# Altium project lab_1_demcheva_usb_rs232.PrjPcb
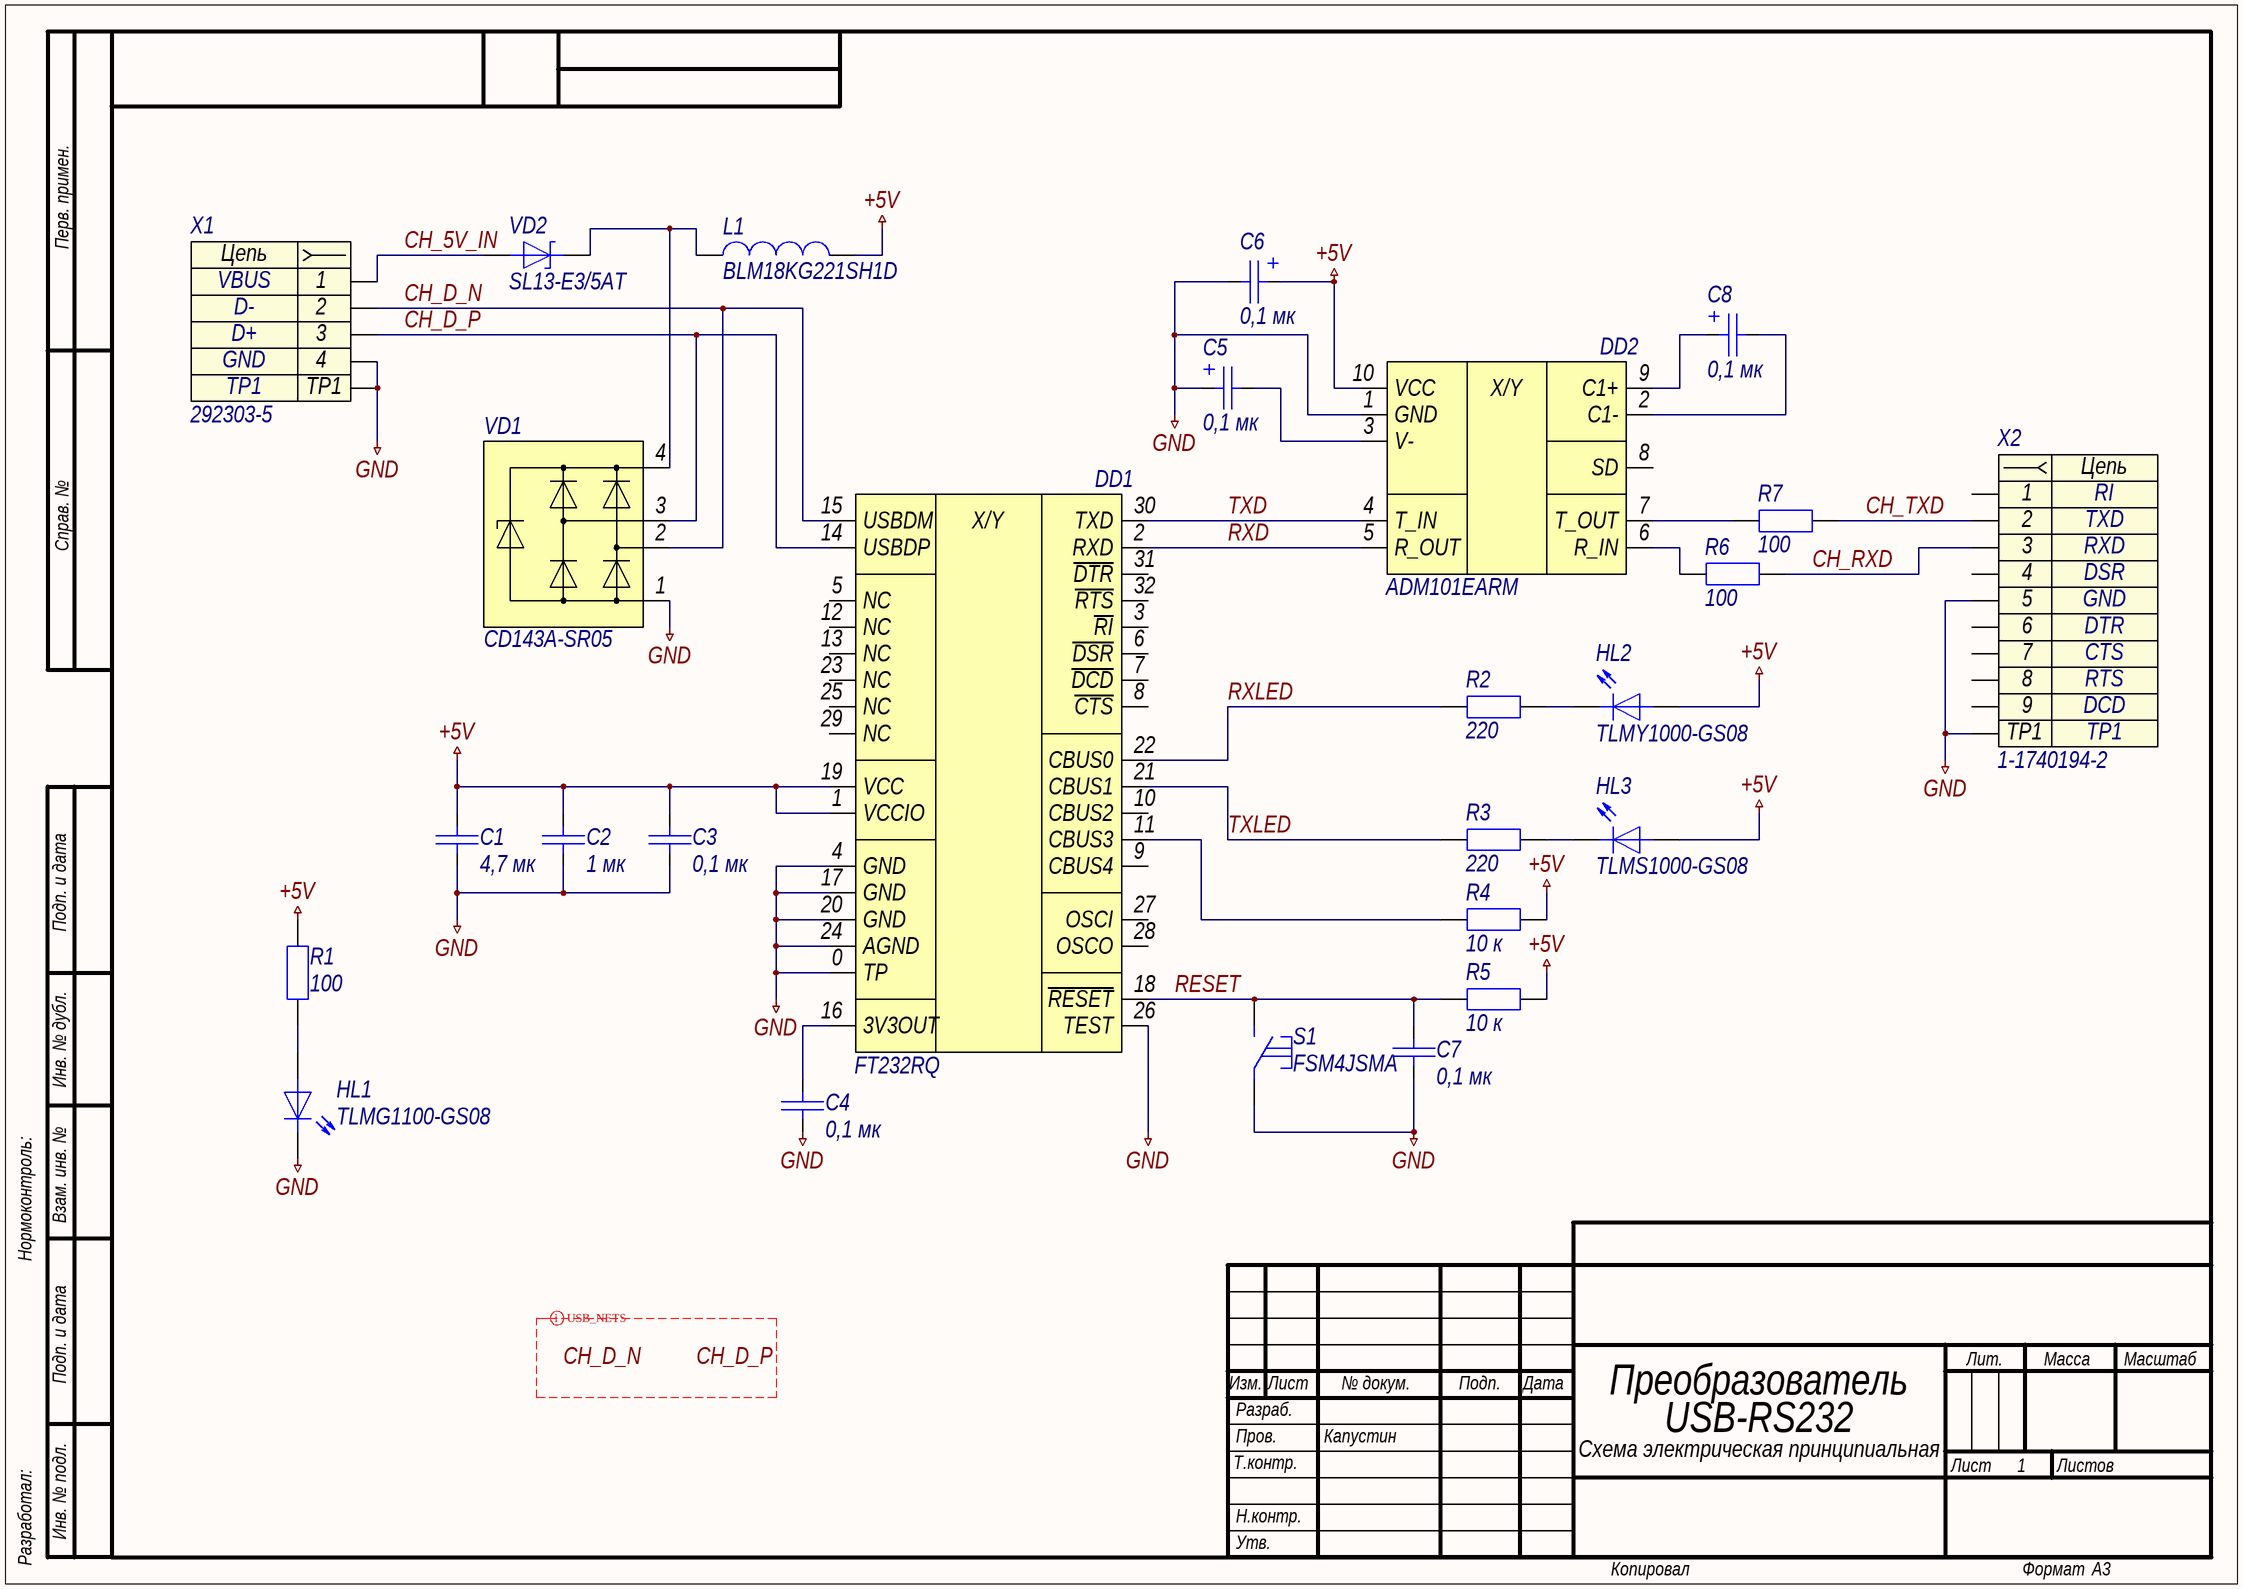
[diagram p0: lab_1_demcheva_usb_rs232.SchDoc]
approver: Капустин; check: Капустин; designation: СПБПУ.3331506.002; developer: Демчева; document_code: Ý3; document_type: Схема электрическая принципиальная; pcb_dec_number: СПБПУ.3331506.002; project: Преобразователь USB-RS232; sheets_total: 1; title: Преобразователь USB-RS232; title_line_1: Преобразователь; title_line_2: USB-RS232
1 sheet, 26 parts. Net scope: global (net labels, ports and power ports of the same name join across sheets).
Board file: lab_1_demcheva_usb_rs232.PcbDoc

## Sheet lab_1_demcheva_usb_rs232.SchDoc: Преобразователь USB-RS232
size 420 x 297 mm; ApprovedBy: Капустин; CheckedBy: Капустин; DrawnBy: Демчева; DocumentNumber: СПБПУ.3331506.002Ý3; SheetNumber: 1; SheetTotal: 1; DocumentCode: Ý3; ImagePath: СПБПУ.3331506.002

### Parts
C1  4,7 мк  [C0603]
C2  1 мк  [C0603]
C3  0,1 мк  [C0603]
C4  0,1 мк  [C0603]
C5  0,1 мк  [C1206POLAR]
C6  0,1 мк  [C1206POLAR]
C7  0,1 мк  [C0603]
C8  0,1 мк  [C1206POLAR]
DD1  FT232RQ  [QFN-32-500x500x90]
DD2  ADM101EARM  [MSOP-10]
HL1  TLMG1100-GS08  [HL0603]
HL2  TLMY1000-GS08  [HL0603]
HL3  TLMS1000-GS08  [HL0603]
L1  BLM18KG221SH1D  [BLM-2-0603]
R1  100  [R0603]
R2  220  [R0603]
R3  220  [R0603]
R4  10 к  [R0603]
R5  10 к  [R0603]
R6  100  [R0603]
R7  100  [R0603]
S1  FSM4JSMA  [FSM4JSMA]
VD1  CD143A-SR05  [SOT-143-4]
VD2  SL13-E3/5AT  [DO-214AC]
X1  292303-5  [292303-5]
X2  1-1740194-2  [1-1740194-2]

### Nets
+5V: C1.1 C2.1 C3.1 C6.1 DD1.1(VCCIO) DD1.19(VCC) DD2.10(VCC) HL2.2 HL3.2 L1.2 R1.2 R4.2 R5.2
GND: C1.2 C2.2 C3.2 C4.2 C5.1 C6.2 C7.2 DD1.0(TP) DD1.4(GND) DD1.17(GND) DD1.20(GND) DD1.24(AGND) DD1.26(TEST) DD2.1(GND) HL1.1 S1.1 VD1.1 X1.4 X1.TP1 X2.5 X2.TP1
CH_5V_IN: VD2.2 X1.1
CH_D_N: DD1.15(USBDM) VD1.2 X1.2
CH_D_P: DD1.14(USBDP) VD1.3 X1.3
CH_RXD: R6.2 X2.3
CH_TXD: R7.2 X2.2
RESET: C7.1 DD1.18(~{RESET}) R5.1 S1.2
RXD: DD1.2(RXD) DD2.5(R_OUT)
RXLED: DD1.22(CBUS0) R2.1
TXD: DD1.30(TXD) DD2.4(T_IN)
TXLED: DD1.21(CBUS1) R3.1
NetC4_1: C4.1 DD1.16(3V3OUT)
NetC5_2: C5.2 DD2.3(V-)
NetC8_1: C8.1 DD2.9(C1+)
NetC8_2: C8.2 DD2.2(C1-)
NetDD1_11: DD1.11(CBUS3) R4.1
NetDD2_6: DD2.6(R_IN) R6.1
NetDD2_7: DD2.7(T_OUT) R7.1
NetHL1_2: HL1.2 R1.1
NetHL2_1: HL2.1 R2.2
NetHL3_1: HL3.1 R3.2
NetL1_1: L1.1 VD1.4 VD2.1

Not connected (* = marked no-connect by the designer): DD1 3(~{RI}) 5(NC) 6(~{DSR}) 7(~{DCD}) 8(~{CTS}) 9(CBUS4) 10(CBUS2) 12(NC) 13(NC) 23(NC) 25(NC) 27(OSCI) 28(OSCO) 29(NC) 31(~{DTR}) 32(~{RTS}); DD2 8(SD); X2 1 4 6 7 8 9

### Layout directives
differential pair; rule Differential Pairs Routing [Pref Gap = 0.254mm    Min Gap  = 0.15mm    Max Gap  = 0.254mmPref Width = 0.381mm    Min Width  = 0.155mm    Max Width  = 0.381mm]; differential pair class USB_SIGNALS: CH_D_N, CH_D_P

### Notes on the sheet
- Labels drawn without touching a wire or pin: CH_D_N, CH_D_P
- Перв. примен.
- Справ. №
- Подп. и дата
- Инв. № дубл.
- Нормоконтроль:
- Взам. инв. №
- Изм.
- Лист
- № докум.
- Подп.
- Дата
- Лит.
- Масса
- Масштаб
- Т.контр.
- Пров.
- Разраб.
- Листов
- Разработал:
- Инв. № подл.
- Н.контр.
- Утв.
- Копировал
- Формат
- А3
- (in symbol dd0008) X/Y
- (in symbol dd0013) X/Y
- (in symbol x0002) Цепь
- (in symbol x0003) Цепь

### Library data of the parts
C1 = c0009: =Описание; ID: c0009; Фамилия: Ларионов; Описание: Конденсатор чип 0603 4,7 мкФ 25 В ±10 %; Наименование: CC0603KRX5R8BB475; Производитель: Yageo; Отклонение: ±10 %; Номинальное напряжение: 25 В; Рабочие температуры: от -55 °С до +85 °С; Корпус: 0603; Номинал: 4,7 мк; HelpURL: https://www.yageo.com/upload/media/product/productsearch/datasheet/mlcc/UPY-GPHC_X5R_4V-to-50V_26.pdf
C2 = c0007: =Описание; ID: c0007; Фамилия: Ларионов; Описание: Конденсатор чип 0603 1 мкФ 25 В ±10 %; Наименование: CC0603KRX7R8BB105; Производитель: Yageo; Отклонение: ±10 %; Номинальное напряжение: 25 В; Рабочие температуры: от -55 °С до +125 °С; Корпус: 0603; Номинал: 1 мк; HelpURL: https://www.yageo.com/upload/media/product/products/datasheet/mlcc/UPY-GPHC_X7R_6.3V-to-50V_20.pdf
C3 C4 C7 = c0005: =Описание; ID: c0005; Фамилия: Ларионов; Описание: Конденсатор чип 0603 0,1 мкФ 50 В ±5 %; Наименование: CC0603JRX7R9BB104; Производитель: Yageo; Отклонение: ±5 %; Номинальное напряжение: 50 В; Рабочие температуры: от -55 °С до +125 °С; Корпус: 0603; Номинал: 0,1 мк; HelpURL: https://www.yageo.com/upload/media/product/products/datasheet/mlcc/UPY-GPHC_X7R_6.3V-to-50V_20.pdf
C5 C6 C8 = c0011: =Описание; ID: c0011; Фамилия: Ларионов; Описание: Конденсатор чип 1206 0,1 мкФ 50 В ±10 % полярный; Наименование: 293D104X9050A2TE3; Производитель: Vishay Intertechnology, Inc.; Отклонение: ±10 %; Номинальное напряжение: 50 В; Рабочие температуры: от -55 °С до +125 °С; Корпус: 1206; Номинал: 0,1 мк; HelpURL: https://www.vishay.com/capacitors/list/product-40002/
DD1 = dd0013: =Описание; ID: dd0013; Фамилия: Демчева; Описание: Преобразователь USB-UART; Производитель: FTDI Limited; Корпус: QFN-32; Наименование: FT232RQ; HelpURL: https://www.ftdichip.com/Products/ICs/FT232R.htm
DD2 = dd0008: =Описание; ID: dd0008; Фамилия: Демчева; Описание: Приемопередатчик RS-232; Производитель: Analog Devices, Inc.; Наименование: ADM101EARM; Корпус: MSOP-10; HelpURL: https://www.analog.com/ru/products/adm101e.html#product-documentation
HL1 = hl0005: =Описание; ID: hl0005; Фамилия: Ларионов; Описание: Светодиод чип 0603 зеленый; Производитель: Vishay Intertechnology, Inc.; Цвет: Green; Номинальная сила света: 35 мкд; Номинальная длина волны: 570 нм; Номинальный прямой ток: 30 мА; Номинальное падение напряжения: 2,1 В; Рассеиваемая мощность: 90 мВт; Рабочие температуры: от -40 °С до +100 °С; Корпус: 0603; Наименование: TLMG1100-GS08; HelpURL: https://www.vishay.com/leds/list/product-83173/
HL2 = hl0003: =Описание; ID: hl0003; Фамилия: Ларионов; Описание: Светодиод чип 0603 желтый; Производитель: Vishay Intertechnology, Inc.; Цвет: Yellow; Номинальная сила света: 7,5 мкд; Номинальная длина волны: 588 нм; Номинальный прямой ток: 15 мА; Номинальное падение напряжения: 1,8 В; Рассеиваемая мощность: 40 мВт; Рабочие температуры: от -40 °С до +100 °С; Корпус: 0603; Наименование: TLMY1000-GS08; HelpURL: https://www.vishay.com/leds/list/product-83172/
HL3 = hl0001: =Описание; ID: hl0001; Фамилия: Ларионов; Описание: Светодиод чип 0603 красный; Производитель: Vishay Intertechnology, Inc.; Цвет: Red; Номинальная сила света: 4 мкд; Номинальная длина волны: 628 нм; Номинальный прямой ток: 15 мА; Номинальное падение напряжения: 1,8 В; Рассеиваемая мощность: 40 мВт; Рабочие температуры: от -40 °С до +100 °С; Корпус: 0603; Наименование: TLMS1000-GS08; HelpURL: https://www.vishay.com/leds/list/product-83172/
L1 = l0001: =Описание; ID: l0001; Фамилия: Ларионов; Описание: Ферритовая бусина 220 Ом ±25 %; Производитель: Murata Manufacturing Co., Ltd.; Сопротивление, 100 МГц: 220 Ом; Отклонение, 100 Мгц: ±25 %; Сопротивление при постоянном токе: 0,05 Ом; Рабочие температуры: от -55 °С до +125 °С; Корпус: 0603; Наименование: BLM18KG221SH1D; HelpURL: https://www.murata.com/en-global/products/productdetail.aspx?partno=BLM18KG221SH1%23
R1 R6 R7 = r0006: =Описание; ID: r0006; Фамилия: Самарин; Описание: Резистор чип 0603 100 Ом ±1 % 0,1 Вт; Наименование: RC0603FR‍‐07100RL; Производитель: Yageo; Отклонение: ±1 %; Номинальное напряжение: 75 В; Рабочие температуры: от -55 °С до +155 °С; Номинальный ток: 1 А; Корпус: 0603; Номинал: 100; HelpURL: https://www.yageo.com/upload/media/product/productsearch/datasheet/rchip/PYu-RC_Group_51_RoHS_L_11.pdf
R2 R3 = r0008: =Описание; ID: r0008; Фамилия: Ларионов; Описание: Резистор чип 0603 220 Ом ±1 % 0,1 Вт; Наименование: RC0603FR-07220RL; Производитель: Yageo; Отклонение: ±1 %; Номинальное напряжение: 75 В; Рабочие температуры: от -55 °С до +155 °С; Номинальный ток: 1 А; Корпус: 0603; Номинал: 220; HelpURL: https://www.yageo.com/upload/media/product/productsearch/datasheet/rchip/PYu-RC_Group_51_RoHS_L_11.pdf
R4 R5 = r0012: =Описание; ID: r0012; Фамилия: Самарин; Описание: Резистор чип 0603 10 кОм ±1 % 0,1 Вт; Наименование: RC0603FR-0710KL; Производитель: Yageo; Отклонение: ±1 %; Номинальное напряжение: 75 В; Рабочие температуры: от -55 °С до +155 °С; Номинальный ток: 1 А; Корпус: 0603; Номинал: 10 к; HelpURL: https://www.yageo.com/upload/media/product/productsearch/datasheet/rchip/PYu-RC_Group_51_RoHS_L_11.pdf
S1 = sw0002: =Описание; ID: sw0002; Фамилия: Паньков; Описание: Тактовая кнопка поверхностного монтажа; Производитель: TE Connectivity; Ток нагрузки: 50 мА @ 24 В; Сопротивление контакта: 100 мОм; Количество контактов: 1; Рабочие температуры: от –35 °С до +85 °С; Промывка: Разрешена; Корпус: 6,00x6,00x4,98; Наименование: FSM4JSMA; HelpURL: https://www.te.com/usa-en/product-4-1437565-1.html
VD1 = vd0013: =Описание; ID: vd0013; Фамилия: Демчева; Описание: Диодная сборка для подавления помех, 5 В; Производитель: Boutns; Корпус: SOT-143-5; Наименование: CD143A-SR05; HelpURL: https://www.bourns.com/products/diodes/diode-arrays/product/CD143A-SR05%20~%2012
VD2 = vd0001: =Описание; ID: vd0001; Фамилия: Ларионов; Описание: Диод Шоттки 30 В 1,5 А; Производитель: Vishay Intertechnology, Inc.; Пиковое прямое напряжение: 0,445 В; Импульсное обратное напряжение: 30 В; Макс допустимый средний прямой ток: 1,5 А; Рабочие температуры: от -55 °С до +125 °С; Наименование: SL13-E3/5AT; Корпус: DO-214AC; HelpURL: https://www.vishay.com/product?docid=88740
X1 = x0003: =Описание; Contact_1: VBUS; Contact_2: D-; Contact_3: D+; Contact_4: GND; ID: x0003; Фамилия: Ларионов; Описание: USB 2.0 Type A гнездо; Производитель: TE Connectivity; Наименование: 292303-5; HelpURL: https://www.te.com/usa-en/product-292303-5.html
X2 = x0002: =Описание; Contact_1: RI; Contact_2: TXD; Contact_3: RXD; Contact_4: DSR; Contact_5: GND; Contact_6: DTR; Contact_7: CTS; Contact_8: RTS; Contact_9: DCD; ID: x0002; Фамилия: Ларионов; Описание: D-Sub 9 pin 2,74 мм гнездо; Производитель: TE Connectivity; Наименование: 1-1740194-2; HelpURL: https://www.te.com/global-en/product-1-1740194-2.html